# Altium schematic sheet JTAG_Configuration.SchDoc
size A4; DocumentNumber: 8; SheetNumber: 8; SheetTotal: 30
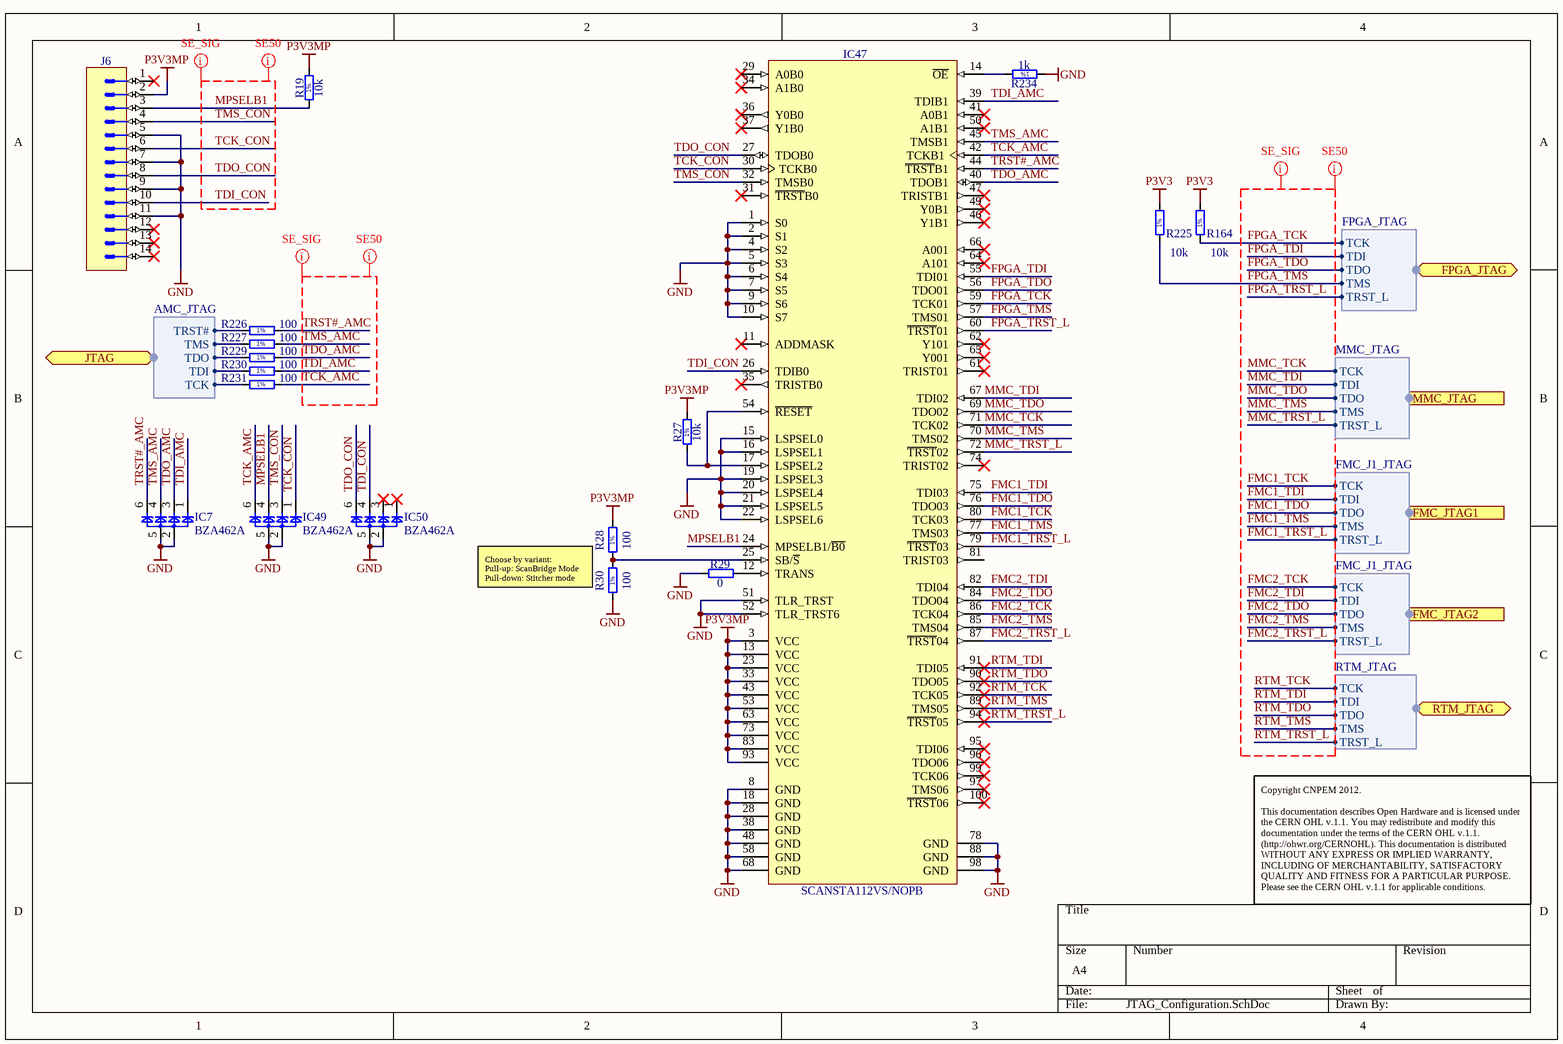
[diagram p0: JTAG_Configuration.SchDoc]

## Parts
IC7  BZA462A  [SOT23-6]
IC47  SCANSTA112VS/NOPB  [QFP50P1600X1600X120-100N]
IC49  BZA462A  [SOT23-6]
IC50  BZA462A  [SOT23-6]
J6  Milli-Grid™  [MOLEX_87832-1420]  (value not drawn)
R19  10k  [RESC1608X55N]
R27  10k  [RESC1608X55N]
R28  100  [RESC1005X40N]
R29  0  [RESC1608X55N]
R30  100  [RESC1005X40N]
R164  10k  [RESC1005X40N]
R225  10k  [RESC1005X40N]
R226  100  [RESC1005X40N]
R227  100  [RESC1005X40N]
R229  100  [RESC1005X40N]
R230  100  [RESC1005X40N]
R231  100  [RESC1005X40N]
R234  1k  [RESC1005X40N]

## Ports
FMC_JTAG1 (harness FMC_J1_JTAG), FMC_JTAG2 (harness FMC_J1_JTAG), FPGA_JTAG (harness FPGA_JTAG), JTAG (harness AMC_JTAG), MMC_JTAG (harness MMC_JTAG), RTM_JTAG (harness RTM_JTAG)

## Harnesses
AMC_JTAG: TCK, TDI, TDO, TMS, TRST#
RTM_JTAG: TCK, TDI, TDO, TMS, TRST_L
FPGA_JTAG: TCK, TDI, TDO, TMS, TRST_L
FMC_J1_JTAG: TCK, TDI, TDO, TMS, TRST_L
MMC_JTAG: TCK, TDI, TDO, TMS, TRST_L

## Nets
GND: IC7.2 IC7.5 IC47.1(S0) IC47.2(S1) IC47.4(S2) IC47.5(S3) IC47.6(S4) IC47.7(S5) IC47.8(GND) IC47.9(S6) IC47.10(S7) IC47.15(LSPSEL0) IC47.16(LSPSEL1) IC47.18(GND) IC47.19(LSPSEL3) IC47.20(LSPSEL4) IC47.21(LSPSEL5) IC47.22(LSPSEL6) IC47.28(GND) IC47.38(GND) IC47.48(GND) IC47.51(TLR_TRST) IC47.52(TLR_TRST6) IC47.58(GND) IC47.68(GND) IC47.78(GND) IC47.88(GND) IC47.98(GND) IC49.2 IC49.5 IC50.2 IC50.5 J6.5 J6.7 J6.9 J6.11 R29.1 R30.1 R234.1
P3V3: R164.2 R225.2
P3V3MP: IC47.3(VCC) IC47.13(VCC) IC47.23(VCC) IC47.33(VCC) IC47.43(VCC) IC47.53(VCC) IC47.63(VCC) IC47.73(VCC) IC47.83(VCC) IC47.93(VCC) J6.2 R19.2 R27.2 R28.2
FMC1_TCK: IC47.80(TCK03) ; port FMC_JTAG1.TCK
FMC1_TDI: IC47.75(TDI03) ; port FMC_JTAG1.TDI
FMC1_TDO: IC47.76(TDO03) ; port FMC_JTAG1.TDO
FMC1_TMS: IC47.77(TMS03) ; port FMC_JTAG1.TMS
FMC1_TRST_L: IC47.79(~{TRST}03) ; port FMC_JTAG1.TRST_L
FMC2_TCK: IC47.86(TCK04) ; port FMC_JTAG2.TCK
FMC2_TDI: IC47.82(TDI04) ; port FMC_JTAG2.TDI
FMC2_TDO: IC47.84(TDO04) ; port FMC_JTAG2.TDO
FMC2_TMS: IC47.85(TMS04) ; port FMC_JTAG2.TMS
FMC2_TRST_L: IC47.87(~{TRST}04) ; port FMC_JTAG2.TRST_L
FPGA_TCK: IC47.59(TCK01) R164.1 ; port FPGA_JTAG.TCK
FPGA_TDI: IC47.55(TDI01) ; port FPGA_JTAG.TDI
FPGA_TDO: IC47.56(TDO01) ; port FPGA_JTAG.TDO
FPGA_TMS: IC47.57(TMS01) R225.1 ; port FPGA_JTAG.TMS
FPGA_TRST_L: IC47.60(~{TRST}01) ; port FPGA_JTAG.TRST_L
MMC_TCK: IC47.71(TCK02) ; port MMC_JTAG.TCK
MMC_TDI: IC47.67(TDI02) ; port MMC_JTAG.TDI
MMC_TDO: IC47.69(TDO02) ; port MMC_JTAG.TDO
MMC_TMS: IC47.70(TMS02) ; port MMC_JTAG.TMS
MMC_TRST_L: IC47.72(~{TRST}02) ; port MMC_JTAG.TRST_L
MPSELB1: IC47.24(MPSELB1/~{B0}) IC49.4 J6.3 R19.1
RTM_TCK: IC47.92(TCK05) ; port RTM_JTAG.TCK
RTM_TDI: IC47.91(TDI05) ; port RTM_JTAG.TDI
RTM_TDO: IC47.90(TDO05) ; port RTM_JTAG.TDO
RTM_TMS: IC47.89(TMS05) ; port RTM_JTAG.TMS
RTM_TRST_L: IC47.94(~{TRST}05) ; port RTM_JTAG.TRST_L
TCK_AMC: IC47.42(TCKB1) IC49.6 R231.2
TCK_CON: IC47.30(TCKB0) IC49.1 J6.6
TDI_AMC: IC7.1 IC47.39(TDIB1) R230.2
TDI_CON: IC47.26(TDIB0) IC50.4 J6.10
TDO_AMC: IC7.3 IC47.40(TDOB1) R229.2
TDO_CON: IC47.27(TDOB0) IC50.6 J6.8
TMS_AMC: IC7.4 IC47.45(TMSB1) R227.2
TMS_CON: IC47.32(TMSB0) IC49.3 J6.4
TRST#_AMC: IC7.6 IC47.44(~{TRST}B1) R226.2
NetIC47_12: IC47.12(TRANS) R29.2
NetIC47_14: IC47.14(~{OE}) R234.2
NetIC47_17: IC47.17(LSPSEL2) IC47.54(~{RESET}) R27.1
NetIC47_25: IC47.25(SB/~{S}) R28.1 R30.2
NetR226_1: R226.1 ; port JTAG.TRST#
NetR227_1: R227.1 ; port JTAG.TMS
NetR229_1: R229.1 ; port JTAG.TDO
NetR230_1: R230.1 ; port JTAG.TDI
NetR231_1: R231.1 ; port JTAG.TCK

Not connected (* = marked no-connect by the designer): IC47 11(ADDMASK)* 29(A0B0)* 31(~{TRST}B0)* 34(A1B0)* 35(TRISTB0)* 36(Y0B0)* 37(Y1B0)* 41(A0B1)* 46(Y1B1)* 47(TRISTB1)* 49(Y0B1)* 50(A1B1)* 61(TRIST01)* 62(Y101)* 64(A101)* 65(Y001)* 66(A001)* 74(TRIST02)* 81(TRIST03) 95(TDI06)* 96(TDO06)* 97(TMS06)* 99(TCK06)* 100(~{TRST}06)*; IC50 1* 3*; J6 1* 12* 13* 14*

## Layout directives
net class SE_SIG: FMC1_TCK, FMC1_TDI, FMC1_TDO, FMC1_TMS, FMC1_TRST_L, FMC2_TCK, FMC2_TDI, FMC2_TDO, FMC2_TMS, FMC2_TRST_L, FPGA_TCK, FPGA_TDI, FPGA_TDO, FPGA_TMS, FPGA_TRST_L, MMC_TCK, MMC_TDI, MMC_TDO, MMC_TMS, MMC_TRST_L, MPSELB1, RTM_TCK, RTM_TDI, RTM_TDO, RTM_TMS, RTM_TRST_L, TCK_AMC, TCK_CON, TDI_AMC, TDI_CON, TDO_AMC, TDO_CON, TMS_AMC, TMS_CON, TRST#_AMC
net class SE50: FMC1_TCK, FMC1_TDI, FMC1_TDO, FMC1_TMS, FMC1_TRST_L, FMC2_TCK, FMC2_TDI, FMC2_TDO, FMC2_TMS, FMC2_TRST_L, FPGA_TCK, FPGA_TDI, FPGA_TDO, FPGA_TMS, FPGA_TRST_L, MMC_TCK, MMC_TDI, MMC_TDO, MMC_TMS, MMC_TRST_L, MPSELB1, RTM_TCK, RTM_TDI, RTM_TDO, RTM_TMS, RTM_TRST_L, TCK_AMC, TCK_CON, TDI_AMC, TDI_CON, TDO_AMC, TDO_CON, TMS_AMC, TMS_CON, TRST#_AMC

## Notes on the sheet
- Choose by variant:
  Pull-up: ScanBridge Mode
  Pull-down: Stitcher mode
- Copyright CNPEM 2012.
  This documentation describes Open Hardware and is licensed under the CERN OHL v.1.1. You may redistribute and modify this documentation under the terms of the CERN OHL v.1.1. (http://ohwr.org/CERNOHL). This documentation is distributed WITHOUT ANY EXPRESS OR IMPLIED WARRANTY, INCLUDING OF MERCHANTABILITY, SATISFACTORY QUALITY AND FITNESS FOR A PARTICULAR PURPOSE. Please see the CERN OHL v.1.1 for applicable conditions.
- (in symbol R0402_1K_1%_0.0625W_100PPM) 1%
- (in symbol R0402_10K_1%_0.0625W_100PPM) 1%
- (in symbol R0402_100R_1%_0.0625W_100PPM) 1%
- (in symbol R0603_10K_1%_0.1W_100PPM) 1%

## Library data of the parts
IC7 IC49 IC50 = D_TVS_BZA462A: Quadruple 4V ESD transient voltage suppressor; Supplier 1: Newark; Supplier Part Number 1: 79R1868
IC47 = SCANSTA112VS/NOPB: 7-Port Multidrop IEEE 1149.1 (JTAG) Multiplexer; Manufacturer: TEXAS INSTRUMENTS; PressFit: No; Bonding: No; Part Number: SCANSTA112VS/NOPB; Component Kind: Standard; Component Type: Standard; Device: SCANSTA112VS/NOPB; PackageDescription: QFP, 0.50mm Pitch, Square; 100 Pin,14.00mm L X 14.00mm W X 1.20mm H Body, IPC Medium Density; Part Description: 7-Port Multidrop IEEE 1149.1 (JTAG) Multiplexer; Manufacturer Part Number: SCANSTA112VS/NOPB; Pin Count: 100; Case: QFP100; Mounted: Yes; Socket: No; SMD: Yes; Sense: No; ComponentHeight: 1.2mm; Author: CERN DEM JLC; HelpURL: \\cern.ch\dfs\Applications\Altium\Datasheets\SCANSTA112VS-NOPB.pdf; CreateDate: 27/10/2016; LatestRevisionDate: 27/10/2016
J6 = MOLEX_87832-1420: Connector 14 Male; Part Description: 2.00mm (.079") Pitch Milli-Grid™ Header, Surface Mount, Vertical, Shrouded, 14 Circuits,with Locking Windows and Centre Polarization Slot, PCB Locator; Manufacturer: MOLEX; Part Number: MOLEX_87832-1420; Component Kind: Standard; Component Type: Standard; Pin Count: 14; Family: Milli-Grid™; Mounted: Yes; Socket: No; SMD: Yes; Status: None; Manufacturer Part Number: 87832-1420; ComponentHeight: 6.4mm; HelpURL: \\cern.ch\dfs\Applications\Altium\Datasheets\MOLEX_87832-1420.pdf; Author: CERN DEM JLC; CreateDate: 2008-09-09; LatestRevisionDate: 2008-09-09; Table: MOLEX
R19 R27 = R0603_10K_1%_0.1W_100PPM: Resistor - 1%; Part Description: General Purpose Thick Film Chip Resistor; Manufacturer: GENERIC; Manufacturer1 Part Number: NRC06F1002TRF; Power: 0.1W; TC: ±100ppm/°C; Part Number: R0603_10K_1%_0.1W_100PPM; Component Kind: Standard; Component Type: Standard; Pin Count: 2; Value: 10k; Status: Preferred; Tolerance: ±1%; Manufacturer Part Number: R0603_10K_1%_0.1W_100PPM; Case: 0603; Mounted: Yes; Sense: No; Socket: No; SMD: Yes; Manufacturer1 Example: NIC COMPONENT; Manufacturer1 ComponentHeight: 0.55mm; HelpURL: \\cern.ch\dfs\Applications\Altium\Datasheets\R0603_NIC_NRC.pdf; Author: CERN DEM JLC; CreateDate: 03/12/2007; LatestRevisionDate: 13/03/2008
R28 R30 R226 R227 R229-R231 = R0402_100R_1%_0.0625W_100PPM: Resistor - 1%; Part Description: General Purpose Thick Film Chip Resistor; Manufacturer: GENERIC; Manufacturer1 Part Number: 232270671001L; TC: ±100ppm/°C; Table: Resistors SMD; Part Number: R0402_100R_1%_0.0625W_100PPM; Component Kind: Standard; Component Type: Standard; Pin Count: 2; Value: 100; Status: Not recommended; Power: 0.0625W; Tolerance: ±1%; Manufacturer Part Number: R0402_100R_1%_0.0625W_100PPM; Case: 0402; Mounted: Yes; Socket: No; SMD: Yes; Manufacturer1 Example: YAGEO PHYCOMP; Manufacturer1 ComponentHeight: 0.4mm; HelpURL: \\cern.ch\dfs\Applications\Altium\Datasheets\R0402_Phycomp_RC0402.pdf; Author: CERN DEM JLC; CreateDate: 2007-12-03; LatestRevisionDate: 2012-10-17
R29 = R0603_0R_JUMPER: Resistor; Part Description: 1A (0.05R Max DC Resistance) Zero Ohm Jumper; Manufacturer: GENERIC; Manufacturer1 Part Number: NRC06Z0; Part Number: R0603_0R_JUMPER; Component Kind: Standard; Component Type: Standard; Pin Count: 2; Value: 0; Status: Preferred; Manufacturer Part Number: R0603_0R_JUMPER; Case: 0603; Mounted: Yes; Sense: No; Socket: No; SMD: Yes; Manufacturer1 Example: NIC COMPONENT; Manufacturer1 ComponentHeight: 0.55mm; HelpURL: \\cern.ch\dfs\Applications\Altium\Datasheets\R0603_NIC_NRC.pdf; Author: CERN DEM JLC; CreateDate: 03/12/2007; LatestRevisionDate: 13/03/2008
R164 R225 = R0402_10K_1%_0.0625W_100PPM: Resistor - 1%; Part Description: General Purpose Thick Film Chip Resistor; Manufacturer: GENERIC; Manufacturer1 Part Number: 232270671003L; TC: ±100ppm/°C; Table: Resistors SMD; Part Number: R0402_10K_1%_0.0625W_100PPM; Component Kind: Standard; Component Type: Standard; Pin Count: 2; Value: 10k; Status: Not recommended; Power: 0.0625W; Tolerance: ±1%; Manufacturer Part Number: R0402_10K_1%_0.0625W_100PPM; Case: 0402; Mounted: Yes; Socket: No; SMD: Yes; Manufacturer1 Example: YAGEO PHYCOMP; Manufacturer1 ComponentHeight: 0.4mm; HelpURL: \\cern.ch\dfs\Applications\Altium\Datasheets\R0402_Phycomp_RC0402.pdf; Author: CERN DEM JLC; CreateDate: 2007-12-03; LatestRevisionDate: 2012-10-17
R234 = R0402_1K_1%_0.0625W_100PPM: Resistor - 1%; Part Description: General Purpose Thick Film Chip Resistor; Manufacturer: GENERIC; Manufacturer1 Part Number: 232270671002L; TC: ±100ppm/°C; Table: Resistors SMD; Part Number: R0402_1K_1%_0.0625W_100PPM; Component Kind: Standard; Component Type: Standard; Pin Count: 2; Value: 1k; Status: Not recommended; Power: 0.0625W; Tolerance: ±1%; Manufacturer Part Number: R0402_1K_1%_0.0625W_100PPM; Case: 0402; Mounted: Yes; Socket: No; SMD: Yes; Manufacturer1 Example: YAGEO PHYCOMP; Manufacturer1 ComponentHeight: 0.4mm; HelpURL: \\cern.ch\dfs\Applications\Altium\Datasheets\R0402_Phycomp_RC0402.pdf; Author: CERN DEM JLC; CreateDate: 2007-12-03; LatestRevisionDate: 2012-10-17